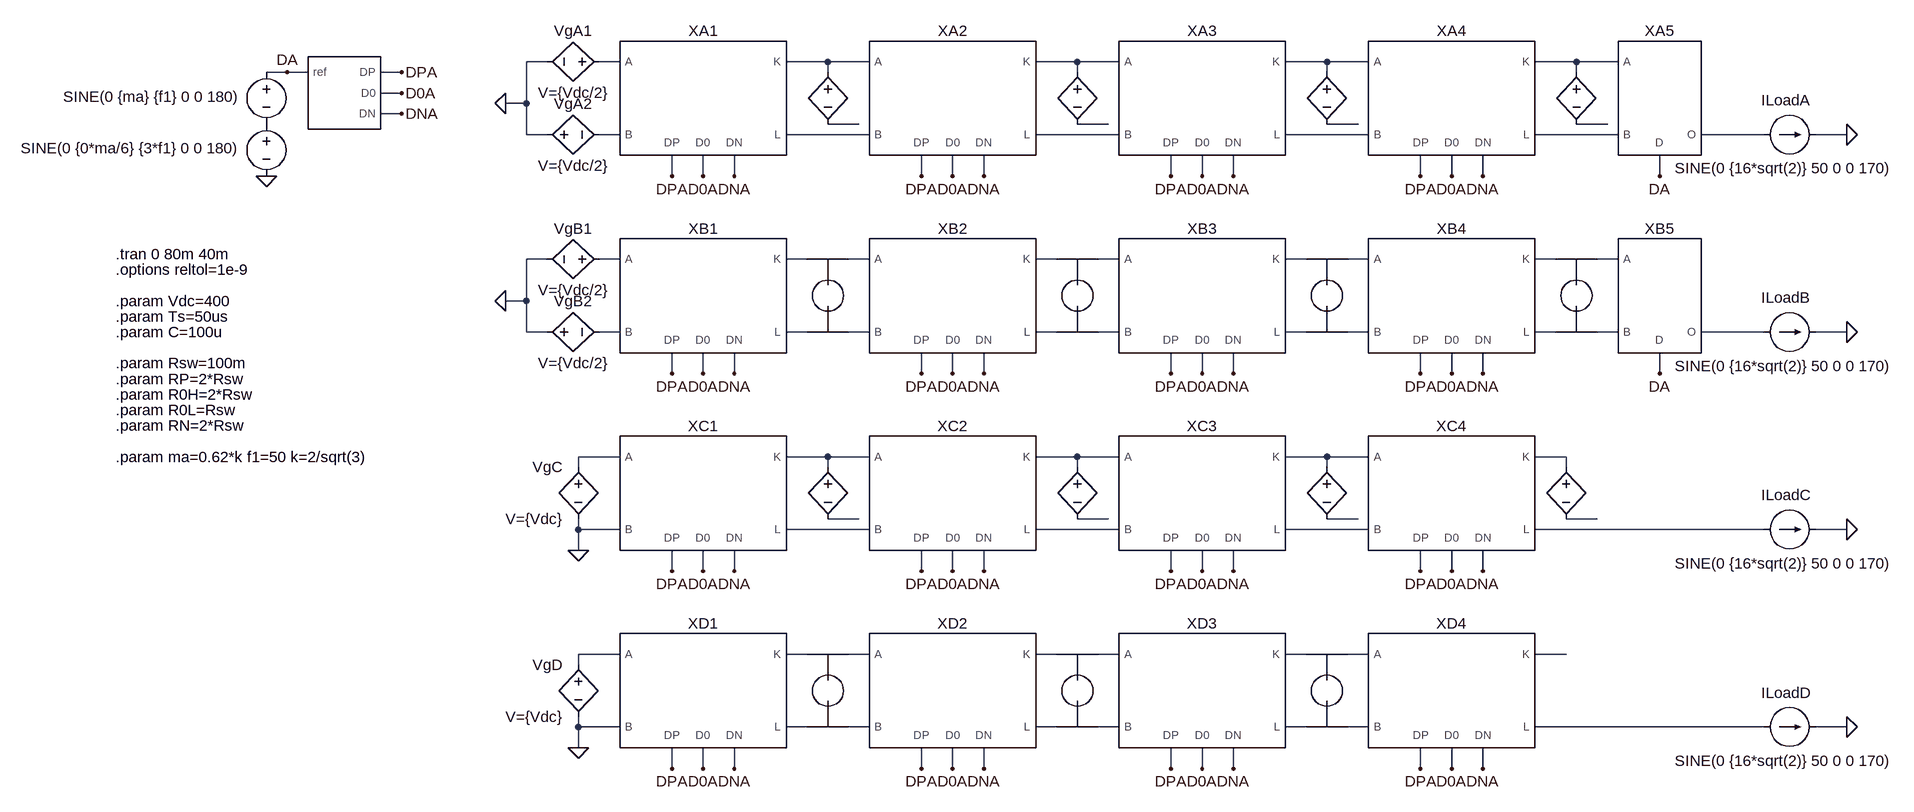
[diagram p0: schematic converter_scaling_ideal.asc]
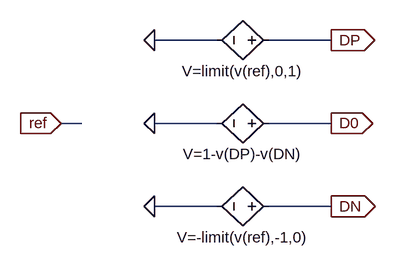
[diagram p1: sub-circuit pn_average_modulator.asc]
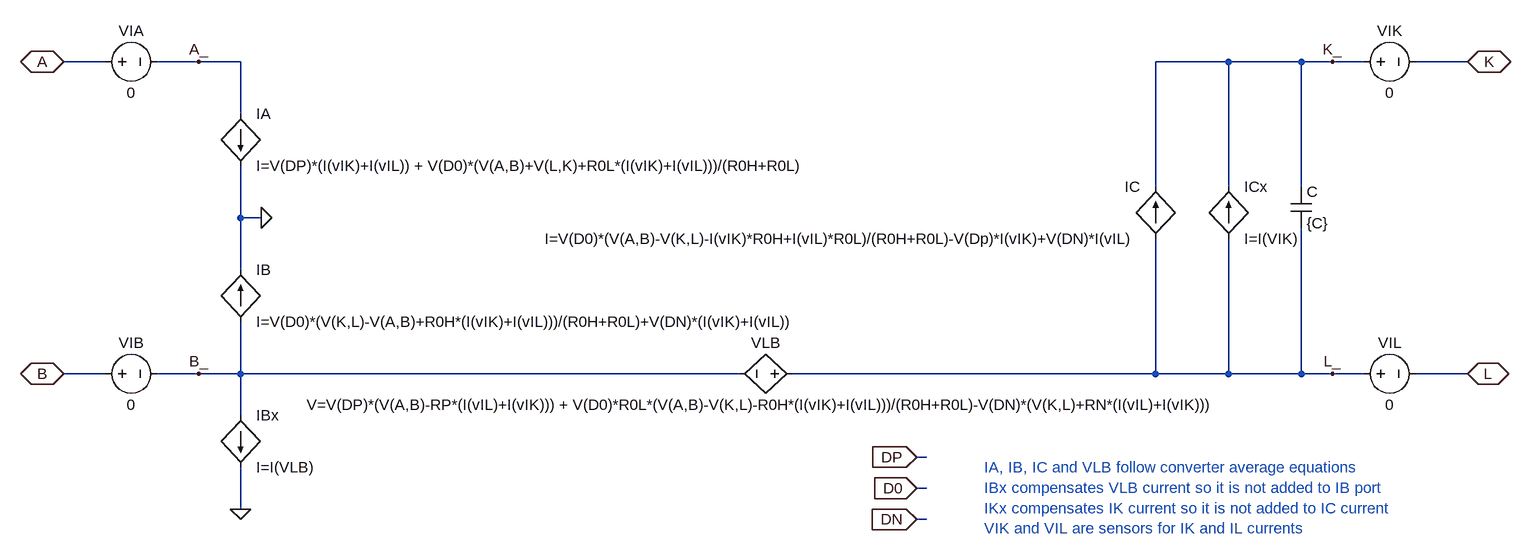
[diagram p2: sub-circuit pn_average_model.asc]
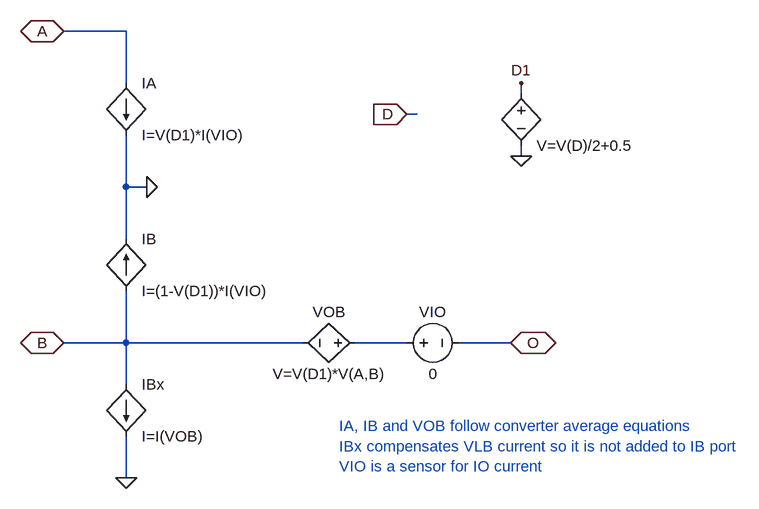
[diagram p3: sub-circuit 2l_average_model.asc]
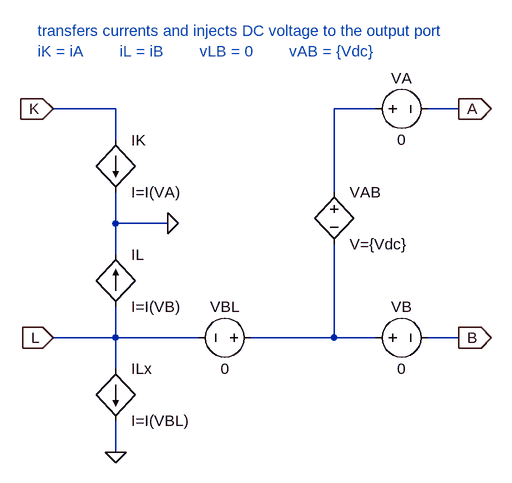
[diagram p4: sub-circuit dc_voltage_injector.asc]
converter_scaling_ideal.asc, the LTspice schematic file:
Version 4
SHEET 1 4616 1844
WIRE 2144 -1392 2112 -1392
WIRE 2256 -1392 2224 -1392
WIRE 2576 -1392 2512 -1392
WIRE 2640 -1392 2576 -1392
WIRE 2960 -1392 2896 -1392
WIRE 3024 -1392 2960 -1392
WIRE 3344 -1392 3280 -1392
WIRE 3408 -1392 3344 -1392
WIRE 3728 -1392 3664 -1392
WIRE 3792 -1392 3728 -1392
WIRE 1744 -1376 1712 -1376
WIRE 1776 -1376 1744 -1376
WIRE 1920 -1376 1888 -1376
WIRE 2576 -1376 2576 -1392
WIRE 2960 -1376 2960 -1392
WIRE 3344 -1376 3344 -1392
WIRE 3728 -1376 3728 -1392
WIRE 1920 -1344 1888 -1344
WIRE 2112 -1328 2112 -1392
WIRE 2112 -1328 2080 -1328
WIRE 1920 -1312 1888 -1312
WIRE 2624 -1296 2576 -1296
WIRE 3008 -1296 2960 -1296
WIRE 3392 -1296 3344 -1296
WIRE 3776 -1296 3728 -1296
WIRE 2112 -1280 2112 -1328
WIRE 2144 -1280 2112 -1280
WIRE 2256 -1280 2224 -1280
WIRE 2640 -1280 2512 -1280
WIRE 3024 -1280 2896 -1280
WIRE 3408 -1280 3280 -1280
WIRE 3792 -1280 3664 -1280
WIRE 4016 -1280 3920 -1280
WIRE 4144 -1280 4096 -1280
WIRE 2336 -1216 2336 -1248
WIRE 2384 -1216 2384 -1248
WIRE 2432 -1216 2432 -1248
WIRE 2720 -1216 2720 -1248
WIRE 2768 -1216 2768 -1248
WIRE 2816 -1216 2816 -1248
WIRE 3104 -1216 3104 -1248
WIRE 3152 -1216 3152 -1248
WIRE 3200 -1216 3200 -1248
WIRE 3488 -1216 3488 -1248
WIRE 3536 -1216 3536 -1248
WIRE 3584 -1216 3584 -1248
WIRE 3856 -1216 3856 -1248
WIRE 2144 -1088 2112 -1088
WIRE 2256 -1088 2224 -1088
WIRE 2544 -1088 2512 -1088
WIRE 2640 -1088 2608 -1088
WIRE 2928 -1088 2896 -1088
WIRE 3024 -1088 2992 -1088
WIRE 3312 -1088 3280 -1088
WIRE 3408 -1088 3376 -1088
WIRE 3696 -1088 3664 -1088
WIRE 3792 -1088 3760 -1088
WIRE 2112 -1024 2112 -1088
WIRE 2112 -1024 2080 -1024
WIRE 2112 -976 2112 -1024
WIRE 2144 -976 2112 -976
WIRE 2256 -976 2224 -976
WIRE 2544 -976 2512 -976
WIRE 2640 -976 2608 -976
WIRE 2928 -976 2896 -976
WIRE 3024 -976 2992 -976
WIRE 3312 -976 3280 -976
WIRE 3408 -976 3376 -976
WIRE 3696 -976 3664 -976
WIRE 3792 -976 3760 -976
WIRE 4016 -976 3920 -976
WIRE 4144 -976 4096 -976
WIRE 2336 -912 2336 -944
WIRE 2384 -912 2384 -944
WIRE 2432 -912 2432 -944
WIRE 2720 -912 2720 -944
WIRE 2768 -912 2768 -944
WIRE 2816 -912 2816 -944
WIRE 3104 -912 3104 -944
WIRE 3152 -912 3152 -944
WIRE 3200 -912 3200 -944
WIRE 3488 -912 3488 -944
WIRE 3536 -912 3536 -944
WIRE 3584 -912 3584 -944
WIRE 3856 -912 3856 -944
WIRE 2256 -784 2192 -784
WIRE 2576 -784 2512 -784
WIRE 2640 -784 2576 -784
WIRE 2960 -784 2896 -784
WIRE 3024 -784 2960 -784
WIRE 3344 -784 3280 -784
WIRE 3408 -784 3344 -784
WIRE 3712 -784 3664 -784
WIRE 2192 -768 2192 -784
WIRE 2576 -768 2576 -784
WIRE 2960 -768 2960 -784
WIRE 3344 -768 3344 -784
WIRE 3712 -768 3712 -784
WIRE 2624 -688 2576 -688
WIRE 3008 -688 2960 -688
WIRE 3392 -688 3344 -688
WIRE 3760 -688 3712 -688
WIRE 2192 -672 2192 -688
WIRE 2256 -672 2192 -672
WIRE 2640 -672 2512 -672
WIRE 3024 -672 2896 -672
WIRE 3408 -672 3280 -672
WIRE 4016 -672 3664 -672
WIRE 4144 -672 4096 -672
WIRE 2192 -640 2192 -672
WIRE 2336 -608 2336 -640
WIRE 2384 -608 2384 -640
WIRE 2432 -608 2432 -640
WIRE 2720 -608 2720 -640
WIRE 2768 -608 2768 -640
WIRE 2816 -608 2816 -640
WIRE 3104 -608 3104 -640
WIRE 3152 -608 3152 -640
WIRE 3200 -608 3200 -640
WIRE 3488 -608 3488 -640
WIRE 3536 -608 3536 -640
WIRE 3584 -608 3584 -640
WIRE 2256 -480 2192 -480
WIRE 2544 -480 2512 -480
WIRE 2640 -480 2608 -480
WIRE 2928 -480 2896 -480
WIRE 3024 -480 2992 -480
WIRE 3312 -480 3280 -480
WIRE 3408 -480 3376 -480
WIRE 3712 -480 3664 -480
WIRE 2192 -464 2192 -480
WIRE 2192 -368 2192 -384
WIRE 2256 -368 2192 -368
WIRE 2544 -368 2512 -368
WIRE 2640 -368 2608 -368
WIRE 2928 -368 2896 -368
WIRE 3024 -368 2992 -368
WIRE 3312 -368 3280 -368
WIRE 3408 -368 3376 -368
WIRE 4016 -368 3664 -368
WIRE 4144 -368 4096 -368
WIRE 2192 -336 2192 -368
WIRE 2336 -304 2336 -336
WIRE 2384 -304 2384 -336
WIRE 2432 -304 2432 -336
WIRE 2720 -304 2720 -336
WIRE 2768 -304 2768 -336
WIRE 2816 -304 2816 -336
WIRE 3104 -304 3104 -336
WIRE 3152 -304 3152 -336
WIRE 3200 -304 3200 -336
WIRE 3488 -304 3488 -336
WIRE 3536 -304 3536 -336
WIRE 3584 -304 3584 -336
FLAG 1920 -1376 DPA
FLAG 1920 -1344 D0A
FLAG 1920 -1312 DNA
FLAG 1712 -1216 0
FLAG 1744 -1376 DA
FLAG 2336 -1216 DPA
FLAG 2384 -1216 D0A
FLAG 2432 -1216 DNA
FLAG 2080 -1328 0
FLAG 4144 -1280 0
FLAG 2720 -1216 DPA
FLAG 2768 -1216 D0A
FLAG 2816 -1216 DNA
FLAG 3104 -1216 DPA
FLAG 3152 -1216 D0A
FLAG 3200 -1216 DNA
FLAG 3488 -1216 DPA
FLAG 3536 -1216 D0A
FLAG 3584 -1216 DNA
FLAG 3856 -1216 DA
FLAG 2336 -608 DPA
FLAG 2384 -608 D0A
FLAG 2432 -608 DNA
FLAG 2192 -640 0
FLAG 4144 -672 0
FLAG 2720 -608 DPA
FLAG 2768 -608 D0A
FLAG 2816 -608 DNA
FLAG 3104 -608 DPA
FLAG 3152 -608 D0A
FLAG 3200 -608 DNA
FLAG 3488 -608 DPA
FLAG 3536 -608 D0A
FLAG 3584 -608 DNA
FLAG 2336 -304 DPA
FLAG 2384 -304 D0A
FLAG 2432 -304 DNA
FLAG 2192 -336 0
FLAG 4144 -368 0
FLAG 2720 -304 DPA
FLAG 2768 -304 D0A
FLAG 2816 -304 DNA
FLAG 3104 -304 DPA
FLAG 3152 -304 D0A
FLAG 3200 -304 DNA
FLAG 3488 -304 DPA
FLAG 3536 -304 D0A
FLAG 3584 -304 DNA
FLAG 2336 -912 DPA
FLAG 2384 -912 D0A
FLAG 2432 -912 DNA
FLAG 4144 -976 0
FLAG 2720 -912 DPA
FLAG 2768 -912 D0A
FLAG 2816 -912 DNA
FLAG 3104 -912 DPA
FLAG 3152 -912 D0A
FLAG 3200 -912 DNA
FLAG 3488 -912 DPA
FLAG 3536 -912 D0A
FLAG 3584 -912 DNA
FLAG 3856 -912 DA
FLAG 2080 -1024 0
SYMBOL voltage 1712 -1392 M0
WINDOW 0 24 16 Invisible 2
WINDOW 3 39 54 Left 2
SYMATTR InstName V1
SYMATTR Value SINE(0 {ma} {f1} 0 0 180)
SYMBOL voltage 1712 -1312 M0
WINDOW 0 24 16 Invisible 2
WINDOW 3 39 53 Left 2
SYMATTR InstName V7
SYMATTR Value SINE(0 {0*ma/6} {3*f1} 0 0 180)
SYMBOL PN_average_modulator 1824 -1344 R0
WINDOW 0 8 -56 Invisible 2
SYMATTR InstName X2
SYMBOL bv 2240 -1392 M270
WINDOW 0 32 56 VTop 2
WINDOW 3 -32 56 VBottom 2
SYMATTR InstName VgA1
SYMATTR Value V={Vdc/2}
SYMBOL PN_average_model 2384 -1344 R0
SYMATTR InstName XA1
SYMATTR SpiceLine C={C*4} RP={RP/4} R0H={R0H/4} R0L={R0L/4} RN={RN/4}
SYMBOL current 4016 -1280 M90
WINDOW 123 0 0 Left 2
WINDOW 39 0 0 Left 2
WINDOW 3 52 -137 VRight 2
WINDOW 0 -53 -4 VRight 2
SYMATTR Value SINE(0 {16*sqrt(2)} 50 0 0 170)
SYMATTR InstName ILoadA
SYMBOL PN_average_model 2768 -1344 R0
SYMATTR InstName XA2
SYMATTR SpiceLine C={C*3} RP={RP/3} R0H={R0H/3} R0L={R0L/3} RN={RN/3}
SYMBOL PN_average_model 3152 -1344 R0
SYMATTR InstName XA3
SYMATTR SpiceLine C={C*2} RP={RP/2} R0H={R0H/2} R0L={R0L/2} RN={RN/2}
SYMBOL PN_average_model 3536 -1344 R0
SYMATTR InstName XA4
SYMATTR SpiceLine C={C} RP={RP} R0H={R0H} R0L={R0L} RN={RN}
SYMBOL 2L_average_model 3856 -1360 R0
SYMATTR InstName XA5
SYMBOL bv 2192 -784 M0
SYMATTR InstName VgC
SYMATTR Value V={Vdc}
SYMBOL PN_average_model 2384 -736 R0
SYMATTR InstName XC1
SYMATTR SpiceLine C={C*4} RP={RP/4} R0H={R0H/4} R0L={R0L/4} RN={RN/4}
SYMBOL current 4016 -672 M90
WINDOW 123 0 0 Left 2
WINDOW 39 0 0 Left 2
WINDOW 3 52 -137 VRight 2
WINDOW 0 -53 -4 VRight 2
SYMATTR Value SINE(0 {16*sqrt(2)} 50 0 0 170)
SYMATTR InstName ILoadC
SYMBOL PN_average_model 2768 -736 R0
SYMATTR InstName XC2
SYMATTR SpiceLine C={C*3} RP={RP/3} R0H={R0H/3} R0L={R0L/3} RN={RN/3}
SYMBOL PN_average_model 3152 -736 R0
SYMATTR InstName XC3
SYMATTR SpiceLine C={C*2} RP={RP/2} R0H={R0H/2} R0L={R0L/2} RN={RN/2}
SYMBOL PN_average_model 3536 -736 R0
SYMATTR InstName XC4
SYMATTR SpiceLine C={C} RP={RP} R0H={R0H} R0L={R0L} RN={RN}
SYMBOL bv 2192 -480 M0
SYMATTR InstName VgD
SYMATTR Value V={Vdc}
SYMBOL PN_average_model 2384 -432 R0
SYMATTR InstName XD1
SYMATTR SpiceLine C={C*4} RP={RP/4} R0H={R0H/4} R0L={R0L/4} RN={RN/4}
SYMBOL current 4016 -368 M90
WINDOW 123 0 0 Left 2
WINDOW 39 0 0 Left 2
WINDOW 3 52 -137 VRight 2
WINDOW 0 -53 -4 VRight 2
SYMATTR Value SINE(0 {16*sqrt(2)} 50 0 0 170)
SYMATTR InstName ILoadD
SYMBOL PN_average_model 2768 -432 R0
SYMATTR InstName XD2
SYMATTR SpiceLine C={C*3} RP={RP/3} R0H={R0H/3} R0L={R0L/3} RN={RN/3}
SYMBOL PN_average_model 3152 -432 R0
SYMATTR InstName XD3
SYMATTR SpiceLine C={C*2} RP={RP/2} R0H={R0H/2} R0L={R0L/2} RN={RN/2}
SYMBOL PN_average_model 3536 -432 R0
SYMATTR InstName XD4
SYMATTR SpiceLine C={C} RP={RP} R0H={R0H} R0L={R0L} RN={RN}
SYMBOL DC_voltage_injector 3344 -432 R0
WINDOW 0 0 -80 Invisible 2
SYMATTR InstName X1
SYMATTR SpiceLine Vdc={Vdc}
SYMBOL DC_voltage_injector 2960 -432 R0
WINDOW 0 0 -80 Invisible 2
SYMATTR InstName X3
SYMATTR SpiceLine Vdc={Vdc}
SYMBOL DC_voltage_injector 2576 -432 R0
WINDOW 0 0 -80 Invisible 2
SYMATTR InstName X4
SYMATTR SpiceLine Vdc={Vdc}
SYMBOL PN_average_model 2384 -1040 R0
SYMATTR InstName XB1
SYMATTR SpiceLine C={C*4} RP={RP/4} R0H={R0H/4} R0L={R0L/4} RN={RN/4}
SYMBOL current 4016 -976 M90
WINDOW 123 0 0 Left 2
WINDOW 39 0 0 Left 2
WINDOW 3 52 -137 VRight 2
WINDOW 0 -53 -4 VRight 2
SYMATTR Value SINE(0 {16*sqrt(2)} 50 0 0 170)
SYMATTR InstName ILoadB
SYMBOL PN_average_model 2768 -1040 R0
SYMATTR InstName XB2
SYMATTR SpiceLine C={C*3} RP={RP/3} R0H={R0H/3} R0L={R0L/3} RN={RN/3}
SYMBOL PN_average_model 3152 -1040 R0
SYMATTR InstName XB3
SYMATTR SpiceLine C={C*2} RP={RP/2} R0H={R0H/2} R0L={R0L/2} RN={RN/2}
SYMBOL PN_average_model 3536 -1040 R0
SYMATTR InstName XB4
SYMATTR SpiceLine C={C} RP={RP} R0H={R0H} R0L={R0L} RN={RN}
SYMBOL 2L_average_model 3856 -1056 R0
SYMATTR InstName XB5
SYMBOL DC_voltage_injector 2576 -1040 R0
WINDOW 0 0 -80 Invisible 2
SYMATTR InstName X5
SYMATTR SpiceLine Vdc={Vdc}
SYMBOL DC_voltage_injector 2960 -1040 R0
WINDOW 0 0 -80 Invisible 2
SYMATTR InstName X6
SYMATTR SpiceLine Vdc={Vdc}
SYMBOL DC_voltage_injector 3344 -1040 R0
WINDOW 0 0 -80 Invisible 2
SYMATTR InstName X7
SYMATTR SpiceLine Vdc={Vdc}
SYMBOL DC_voltage_injector 3728 -1040 R0
WINDOW 0 0 -80 Invisible 2
SYMATTR InstName X8
SYMATTR SpiceLine Vdc={Vdc}
SYMBOL bv 2128 -1280 M90
WINDOW 0 -32 56 VBottom 2
WINDOW 3 32 56 VTop 2
SYMATTR InstName VgA2
SYMATTR Value V={Vdc/2}
SYMBOL bv 2240 -1088 M270
WINDOW 0 32 56 VTop 2
WINDOW 3 -32 56 VBottom 2
SYMATTR InstName VgB1
SYMATTR Value V={Vdc/2}
SYMBOL bv 2128 -976 M90
WINDOW 0 -32 56 VBottom 2
WINDOW 3 32 56 VTop 2
SYMATTR InstName VgB2
SYMATTR Value V={Vdc/2}
SYMBOL bv 2576 -784 M0
WINDOW 0 24 16 Invisible 2
WINDOW 3 24 96 Invisible 2
SYMATTR InstName Vgavg7
SYMATTR Value V={Vdc}
SYMBOL bv 2960 -784 M0
WINDOW 0 24 16 Invisible 2
WINDOW 3 24 96 Invisible 2
SYMATTR InstName Vgavg8
SYMATTR Value V={Vdc}
SYMBOL bv 3344 -784 M0
WINDOW 0 24 16 Invisible 2
WINDOW 3 24 96 Invisible 2
SYMATTR InstName Vgavg9
SYMATTR Value V={Vdc}
SYMBOL bv 3712 -784 M0
WINDOW 0 24 16 Invisible 2
WINDOW 3 24 96 Invisible 2
SYMATTR InstName Vgavg10
SYMATTR Value V={Vdc}
SYMBOL bv 3344 -1392 M0
WINDOW 0 24 16 Invisible 2
WINDOW 3 24 96 Invisible 2
SYMATTR InstName Vgavg11
SYMATTR Value V={Vdc}
SYMBOL bv 2960 -1392 M0
WINDOW 0 24 16 Invisible 2
WINDOW 3 24 96 Invisible 2
SYMATTR InstName Vgavg12
SYMATTR Value V={Vdc}
SYMBOL bv 2576 -1392 M0
WINDOW 0 24 16 Invisible 2
WINDOW 3 24 96 Invisible 2
SYMATTR InstName Vgavg13
SYMATTR Value V={Vdc}
SYMBOL bv 3728 -1392 M0
WINDOW 0 24 16 Invisible 2
WINDOW 3 24 96 Invisible 2
SYMATTR InstName Vgavg14
SYMATTR Value V={Vdc}
TEXT 1480 -1000 Left 2 !.param Ts=50us
TEXT 1480 -1096 Left 2 !.tran 0 80m 40m
TEXT 1480 -1024 Left 2 !.param Vdc=400
TEXT 1480 -784 Left 2 !.param ma=0.62*k f1=50 k=2/sqrt(3)
TEXT 1480 -928 Left 2 !.param Rsw=100m
TEXT 1480 -904 Left 2 !.param RP=2*Rsw
TEXT 1480 -832 Left 2 !.param RN=2*Rsw
TEXT 1480 -880 Left 2 !.param R0H=2*Rsw
TEXT 1480 -856 Left 2 !.param R0L=Rsw
TEXT 1480 -976 Left 2 !.param C=100u
TEXT 1480 -1072 Left 2 !.options reltol=1e-9

pn_average_modulator.asc, the sub-circuit schematic file:
Version 4
SHEET 1 880 680
WIRE 304 160 208 160
WIRE 480 160 384 160
WIRE 96 288 64 288
WIRE 304 288 208 288
WIRE 480 288 384 288
WIRE 304 416 208 416
WIRE 480 416 384 416
FLAG 208 160 0
FLAG 208 288 0
FLAG 208 416 0
FLAG 480 160 DP
IOPIN 480 160 Out
FLAG 480 288 D0
IOPIN 480 288 Out
FLAG 480 416 DN
IOPIN 480 416 Out
FLAG 64 288 ref
IOPIN 64 288 In
SYMBOL bv 400 160 R90
WINDOW 0 -32 56 Invisible 2
WINDOW 3 32 56 VTop 2
SYMATTR InstName Bpos1
SYMATTR Value V=limit(v(ref),0,1)
SYMBOL bv 400 288 R90
WINDOW 0 -32 56 Invisible 2
WINDOW 3 32 56 VTop 2
SYMATTR InstName Bzero1
SYMATTR Value V=1-v(DP)-v(DN)
SYMBOL bv 400 416 R90
WINDOW 0 -32 56 Invisible 2
WINDOW 3 32 56 VTop 2
SYMATTR InstName Bneg1
SYMATTR Value V=-limit(v(ref),-1,0)

pn_average_model.asc, the sub-circuit schematic file:
Version 4
SHEET 1 2060 780
WIRE -720 16 -784 16
WIRE -576 16 -640 16
WIRE -512 16 -576 16
WIRE 1008 16 896 16
WIRE 1120 16 1008 16
WIRE 1168 16 1120 16
WIRE 1216 16 1168 16
WIRE 1376 16 1296 16
WIRE -512 96 -512 16
WIRE 896 208 896 16
WIRE 1008 208 1008 16
WIRE 1120 208 1120 16
WIRE -512 256 -512 176
WIRE -480 256 -512 256
WIRE -512 336 -512 256
WIRE -720 496 -784 496
WIRE -576 496 -640 496
WIRE -512 496 -512 416
WIRE -512 496 -576 496
WIRE 256 496 -512 496
WIRE 896 496 896 288
WIRE 896 496 336 496
WIRE 1008 496 1008 288
WIRE 1008 496 896 496
WIRE 1120 496 1120 272
WIRE 1120 496 1008 496
WIRE 1168 496 1120 496
WIRE 1216 496 1168 496
WIRE 1376 496 1296 496
WIRE -512 560 -512 496
WIRE 544 624 528 624
WIRE 544 672 528 672
WIRE -512 704 -512 640
WIRE 544 720 528 720
FLAG 1376 16 K
IOPIN 1376 16 BiDir
FLAG 1376 496 L
IOPIN 1376 496 BiDir
FLAG -784 16 A
IOPIN -784 16 BiDir
FLAG -784 496 B
IOPIN -784 496 BiDir
FLAG 528 624 DP
IOPIN 528 624 In
FLAG 528 672 D0
IOPIN 528 672 In
FLAG 528 720 DN
IOPIN 528 720 In
FLAG -480 256 0
FLAG -512 704 0
FLAG -576 16 A_
FLAG -576 496 B_
FLAG 1168 16 K_
FLAG 1168 496 L_
SYMBOL bv 352 496 R90
WINDOW 0 -32 56 VBottom 2
WINDOW 3 32 56 VTop 2
SYMATTR InstName VLB
SYMATTR Value V=V(DP)*(V(A,B)-RP*(I(vIL)+I(vIK))) + V(D0)*R0L*(V(A,B)-V(K,L)-R0H*(I(vIK)+I(vIL)))/(R0H+R0L)-V(DN)*(V(K,L)+RN*(I(vIL)+I(vIK)))
SYMBOL bi -512 96 R0
SYMATTR InstName IA
SYMATTR Value I=V(DP)*(I(vIK)+I(vIL)) + V(D0)*(V(A,B)+V(L,K)+R0L*(I(vIK)+I(vIL)))/(R0H+R0L)
SYMBOL cap 1104 208 R0
SYMATTR InstName C
SYMATTR Value {C}
SYMBOL bi 896 288 R180
WINDOW 0 24 80 Left 2
WINDOW 3 24 0 Left 2
SYMATTR InstName IC
SYMATTR Value I=V(D0)*(V(A,B)-V(K,L)-I(vIK)*R0H+I(vIL)*R0L)/(R0H+R0L)-V(Dp)*I(vIK)+V(DN)*I(vIL)
SYMBOL bi -512 416 M180
WINDOW 0 24 80 Left 2
WINDOW 3 24 0 Left 2
SYMATTR InstName IB
SYMATTR Value I=V(D0)*(V(K,L)-V(A,B)+R0H*(I(vIK)+I(vIL)))/(R0H+R0L)+V(DN)*(I(vIK)+I(vIL))
SYMBOL voltage 1200 496 R270
WINDOW 0 32 56 VTop 2
WINDOW 3 -32 56 VBottom 2
SYMATTR InstName VIL
SYMATTR Value 0
SYMBOL voltage 1200 16 R270
WINDOW 0 32 56 VTop 2
WINDOW 3 -32 56 VBottom 2
SYMATTR InstName VIK
SYMATTR Value 0
SYMBOL bi -512 560 R0
SYMATTR InstName IBx
SYMATTR Value I=I(VLB)
SYMBOL bi 1008 288 M180
WINDOW 0 24 80 Left 2
WINDOW 3 24 0 Left 2
SYMATTR InstName ICx
SYMATTR Value I=I(VIK)
SYMBOL voltage -736 496 R270
WINDOW 0 32 56 VTop 2
WINDOW 3 -32 56 VBottom 2
SYMATTR InstName VIB
SYMATTR Value 0
SYMBOL voltage -736 16 R270
WINDOW 0 32 56 VTop 2
WINDOW 3 -32 56 VBottom 2
SYMATTR InstName VIA
SYMATTR Value 0
TEXT 632 640 Left 2 ;IA, IB, IC and VLB follow converter average equations\nIBx compensates VLB current so it is not added to IB port\nIKx compensates IK current so it is not added to IC current\nVIK and VIL are sensors for IK and IL currents

2l_average_model.asc, the sub-circuit schematic file:
Version 4
SHEET 1 2060 780
WIRE -512 16 -608 16
WIRE -512 96 -512 16
WIRE 96 112 96 96
WIRE -64 144 -80 144
WIRE 96 208 96 192
WIRE -512 256 -512 176
WIRE -480 256 -512 256
WIRE -512 336 -512 256
WIRE -512 496 -512 416
WIRE -512 496 -608 496
WIRE -240 496 -512 496
WIRE -80 496 -160 496
WIRE 80 496 0 496
WIRE -512 560 -512 496
WIRE -512 704 -512 640
FLAG 80 496 O
IOPIN 80 496 BiDir
FLAG -608 16 A
IOPIN -608 16 BiDir
FLAG -608 496 B
IOPIN -608 496 BiDir
FLAG -80 144 D
IOPIN -80 144 In
FLAG -480 256 0
FLAG -512 704 0
FLAG 96 208 0
FLAG 96 96 D1
SYMBOL bv -144 496 R90
WINDOW 0 -32 56 VBottom 2
WINDOW 3 32 56 VTop 2
SYMATTR InstName VOB
SYMATTR Value V=V(D1)*V(A,B)
SYMBOL bi -512 96 R0
SYMATTR InstName IA
SYMATTR Value I=V(D1)*I(VIO)
SYMBOL bi -512 416 M180
WINDOW 0 24 80 Left 2
WINDOW 3 24 0 Left 2
SYMATTR InstName IB
SYMATTR Value I=(1-V(D1))*I(VIO)
SYMBOL voltage -96 496 R270
WINDOW 0 32 56 VTop 2
WINDOW 3 -32 56 VBottom 2
SYMATTR InstName VIO
SYMATTR Value 0
SYMBOL bi -512 560 R0
SYMATTR InstName IBx
SYMATTR Value I=I(VOB)
SYMBOL bv 96 96 R0
WINDOW 0 24 16 Invisible 2
SYMATTR InstName VD
SYMATTR Value V=V(D)/2+0.5
TEXT -184 624 Left 2 ;IA, IB and VOB follow converter average equations\nIBx compensates VLB current so it is not added to IB port\nVIO is a sensor for IO current

dc_voltage_injector.asc, the sub-circuit schematic file:
Version 4
SHEET 1 880 720
WIRE 208 64 112 64
WIRE 608 64 544 64
WIRE 736 64 688 64
WIRE 208 112 208 64
WIRE 544 192 544 64
WIRE 208 240 208 192
WIRE 288 240 208 240
WIRE 208 288 208 240
WIRE 208 416 208 368
WIRE 208 416 112 416
WIRE 336 416 208 416
WIRE 544 416 544 272
WIRE 544 416 416 416
WIRE 608 416 544 416
WIRE 736 416 688 416
WIRE 208 464 208 416
WIRE 208 592 208 544
FLAG 736 64 A
IOPIN 736 64 Out
FLAG 736 416 B
IOPIN 736 416 Out
FLAG 112 64 K
IOPIN 112 64 In
FLAG 112 416 L
IOPIN 112 416 In
FLAG 288 240 0
FLAG 208 592 0
SYMBOL bv 544 176 R0
SYMATTR InstName VAB
SYMATTR Value V={Vdc}
SYMBOL bi 208 112 R0
SYMATTR InstName IK
SYMATTR Value I=I(VA)
SYMBOL voltage 592 416 R270
WINDOW 0 32 56 VTop 2
WINDOW 3 -32 56 VBottom 2
SYMATTR InstName VB
SYMATTR Value 0
SYMBOL voltage 432 416 R90
WINDOW 0 -32 56 VBottom 2
WINDOW 3 32 56 VTop 2
SYMATTR InstName VBL
SYMATTR Value 0
SYMBOL voltage 592 64 R270
WINDOW 0 32 56 VTop 2
WINDOW 3 -32 56 VBottom 2
SYMATTR InstName VA
SYMATTR Value 0
SYMBOL bi 208 368 M180
WINDOW 0 24 80 Left 2
WINDOW 3 24 0 Left 2
SYMATTR InstName IL
SYMATTR Value I=I(VB)
SYMBOL bi 208 464 R0
SYMATTR InstName ILx
SYMATTR Value I=I(VBL)
TEXT 88 -56 Left 2 ;transfers currents and injects DC voltage to the output port\niK = iA        iL = iB        vLB = 0        vAB = {Vdc}

The netlist it stands for:
* converter_scaling_ideal.asc
V1 DA P001 SINE(0 {ma} {f1} 0 0 180)
V7 P001 0 SINE(0 {0*ma/6} {3*f1} 0 0 180)
XX2 DA D0A DNA DPA pn_average_modulator
B§VgA1 N001 0 V={Vdc/2}
XXA1 D0A DNA DPA N001 N010 N002 N011 pn_average_model params: C={C*4} RP={RP/4} R0H={R0H/4} R0L={R0L/4} RN={RN/4}
ILoadA N015 0 SINE(0 {16*sqrt(2)} 50 0 0 170)
XXA2 D0A DNA DPA N002 N011 N003 N012 pn_average_model params: C={C*3} RP={RP/3} R0H={R0H/3} R0L={R0L/3} RN={RN/3}
XXA3 D0A DNA DPA N003 N012 N004 N013 pn_average_model params: C={C*2} RP={RP/2} R0H={R0H/2} R0L={R0L/2} RN={RN/2}
XXA4 D0A DNA DPA N004 N013 N005 N014 pn_average_model params: C={C} RP={RP} R0H={R0H} R0L={R0L} RN={RN}
XXA5 DA N005 N014 N015 2l_average_model
B§VgC N035 0 V={Vdc}
XXC1 D0A DNA DPA N035 0 N036 N044 pn_average_model params: C={C*4} RP={RP/4} R0H={R0H/4} R0L={R0L/4} RN={RN/4}
ILoadC N047 0 SINE(0 {16*sqrt(2)} 50 0 0 170)
XXC2 D0A DNA DPA N036 N044 N037 N045 pn_average_model params: C={C*3} RP={RP/3} R0H={R0H/3} R0L={R0L/3} RN={RN/3}
XXC3 D0A DNA DPA N037 N045 N038 N046 pn_average_model params: C={C*2} RP={RP/2} R0H={R0H/2} R0L={R0L/2} RN={RN/2}
XXC4 D0A DNA DPA N038 N046 N039 N047 pn_average_model params: C={C} RP={RP} R0H={R0H} R0L={R0L} RN={RN}
B§VgD N048 0 V={Vdc}
XXD1 D0A DNA DPA N048 0 N049 N056 pn_average_model params: C={C*4} RP={RP/4} R0H={R0H/4} R0L={R0L/4} RN={RN/4}
ILoadD N062 0 SINE(0 {16*sqrt(2)} 50 0 0 170)
XXD2 D0A DNA DPA N050 N057 N051 N058 pn_average_model params: C={C*3} RP={RP/3} R0H={R0H/3} R0L={R0L/3} RN={RN/3}
XXD3 D0A DNA DPA N052 N059 N053 N060 pn_average_model params: C={C*2} RP={RP/2} R0H={R0H/2} R0L={R0L/2} RN={RN/2}
XXD4 D0A DNA DPA N054 N061 N055 N062 pn_average_model params: C={C} RP={RP} R0H={R0H} R0L={R0L} RN={RN}
XX1 N053 N060 N054 N061 dc_voltage_injector params: Vdc={Vdc}
XX3 N051 N058 N052 N059 dc_voltage_injector params: Vdc={Vdc}
XX4 N049 N056 N050 N057 dc_voltage_injector params: Vdc={Vdc}
XXB1 D0A DNA DPA N016 N025 N017 N026 pn_average_model params: C={C*4} RP={RP/4} R0H={R0H/4} R0L={R0L/4} RN={RN/4}
ILoadB N034 0 SINE(0 {16*sqrt(2)} 50 0 0 170)
XXB2 D0A DNA DPA N018 N027 N019 N028 pn_average_model params: C={C*3} RP={RP/3} R0H={R0H/3} R0L={R0L/3} RN={RN/3}
XXB3 D0A DNA DPA N020 N029 N021 N030 pn_average_model params: C={C*2} RP={RP/2} R0H={R0H/2} R0L={R0L/2} RN={RN/2}
XXB4 D0A DNA DPA N022 N031 N023 N032 pn_average_model params: C={C} RP={RP} R0H={R0H} R0L={R0L} RN={RN}
XXB5 DA N024 N033 N034 2l_average_model
XX5 N017 N026 N018 N027 dc_voltage_injector params: Vdc={Vdc}
XX6 N019 N028 N020 N029 dc_voltage_injector params: Vdc={Vdc}
XX7 N021 N030 N022 N031 dc_voltage_injector params: Vdc={Vdc}
XX8 N023 N032 N024 N033 dc_voltage_injector params: Vdc={Vdc}
B§VgA2 0 N010 V={Vdc/2}
B§VgB1 N016 0 V={Vdc/2}
B§VgB2 0 N025 V={Vdc/2}
B§Vgavg7 N036 N040 V={Vdc}
B§Vgavg8 N037 N041 V={Vdc}
B§Vgavg9 N038 N042 V={Vdc}
B§Vgavg10 N039 N043 V={Vdc}
B§Vgavg11 N004 N008 V={Vdc}
B§Vgavg12 N003 N007 V={Vdc}
B§Vgavg13 N002 N006 V={Vdc}
B§Vgavg14 N005 N009 V={Vdc}

* block symbol definitions
.subckt pn_average_modulator ref D0 DN DP
Bpos1 DP 0 V=limit(v(ref),0,1)
Bzero1 D0 0 V=1-v(DP)-v(DN)
Bneg1 DN 0 V=-limit(v(ref),-1,0)
.ends pn_average_modulator

.subckt pn_average_model D0 DN DP A B K L
B§VLB L_ B_ V=V(DP)*(V(A,B)-RP*(I(vIL)+I(vIK))) + V(D0)*R0L*(V(A,B)-V(K,L)-R0H*(I(vIK)+I(vIL)))/(R0H+R0L)-V(DN)*(V(K,L)+RN*(I(vIL)+I(vIK)))
B§IA A_ 0 I=V(DP)*(I(vIK)+I(vIL)) + V(D0)*(V(A,B)+V(L,K)+R0L*(I(vIK)+I(vIL)))/(R0H+R0L)
C K_ L_ {C}
B§IC L_ K_ I=V(D0)*(V(A,B)-V(K,L)-I(vIK)*R0H+I(vIL)*R0L)/(R0H+R0L)-V(Dp)*I(vIK)+V(DN)*I(vIL)
B§IB B_ 0 I=V(D0)*(V(K,L)-V(A,B)+R0H*(I(vIK)+I(vIL)))/(R0H+R0L)+V(DN)*(I(vIK)+I(vIL))
VIL L_ L 0
VIK K_ K 0
B§IBx B_ 0 I=I(VLB)
B§ICx L_ K_ I=I(VIK)
VIB B B_ 0
VIA A A_ 0
* IA, IB, IC and VLB follow converter average equations
* IBx compensates VLB current so it is not added to IB port
* IKx compensates IK current so it is not added to IC current
* VIK and VIL are sensors for IK and IL currents
.ends pn_average_model

.subckt 2l_average_model D A B O
B§VOB N001 B V=V(D1)*V(A,B)
B§IA A 0 I=V(D1)*I(VIO)
B§IB B 0 I=(1-V(D1))*I(VIO)
VIO N001 O 0
B§IBx B 0 I=I(VOB)
B§VD D1 0 V=V(D)/2+0.5
* IA, IB and VOB follow converter average equations
* IBx compensates VLB current so it is not added to IB port
* VIO is a sensor for IO current
.ends 2l_average_model

.subckt dc_voltage_injector K L A B
B§VAB N001 N002 V={Vdc}
B§IK K 0 I=I(VA)
VB N002 B 0
VBL N002 L 0
VA N001 A 0
B§IL L 0 I=I(VB)
B§ILx L 0 I=I(VBL)
* transfers currents and injects DC voltage to the output port
* iK = iA        iL = iB        vLB = 0        vAB = {Vdc}
.ends dc_voltage_injector

.param Ts=50us
.tran 0 80m 40m
.param Vdc=400
.param ma=0.62*k f1=50 k=2/sqrt(3)
.param Rsw=100m
.param RP=2*Rsw
.param RN=2*Rsw
.param R0H=2*Rsw
.param R0L=Rsw
.param C=100u
.options reltol=1e-9
.backanno
.end